# Altium schematic sheet 09_eMMC.SchDoc
size 420 x 297 mm; SheetNumber: 18; SheetTotal: 36
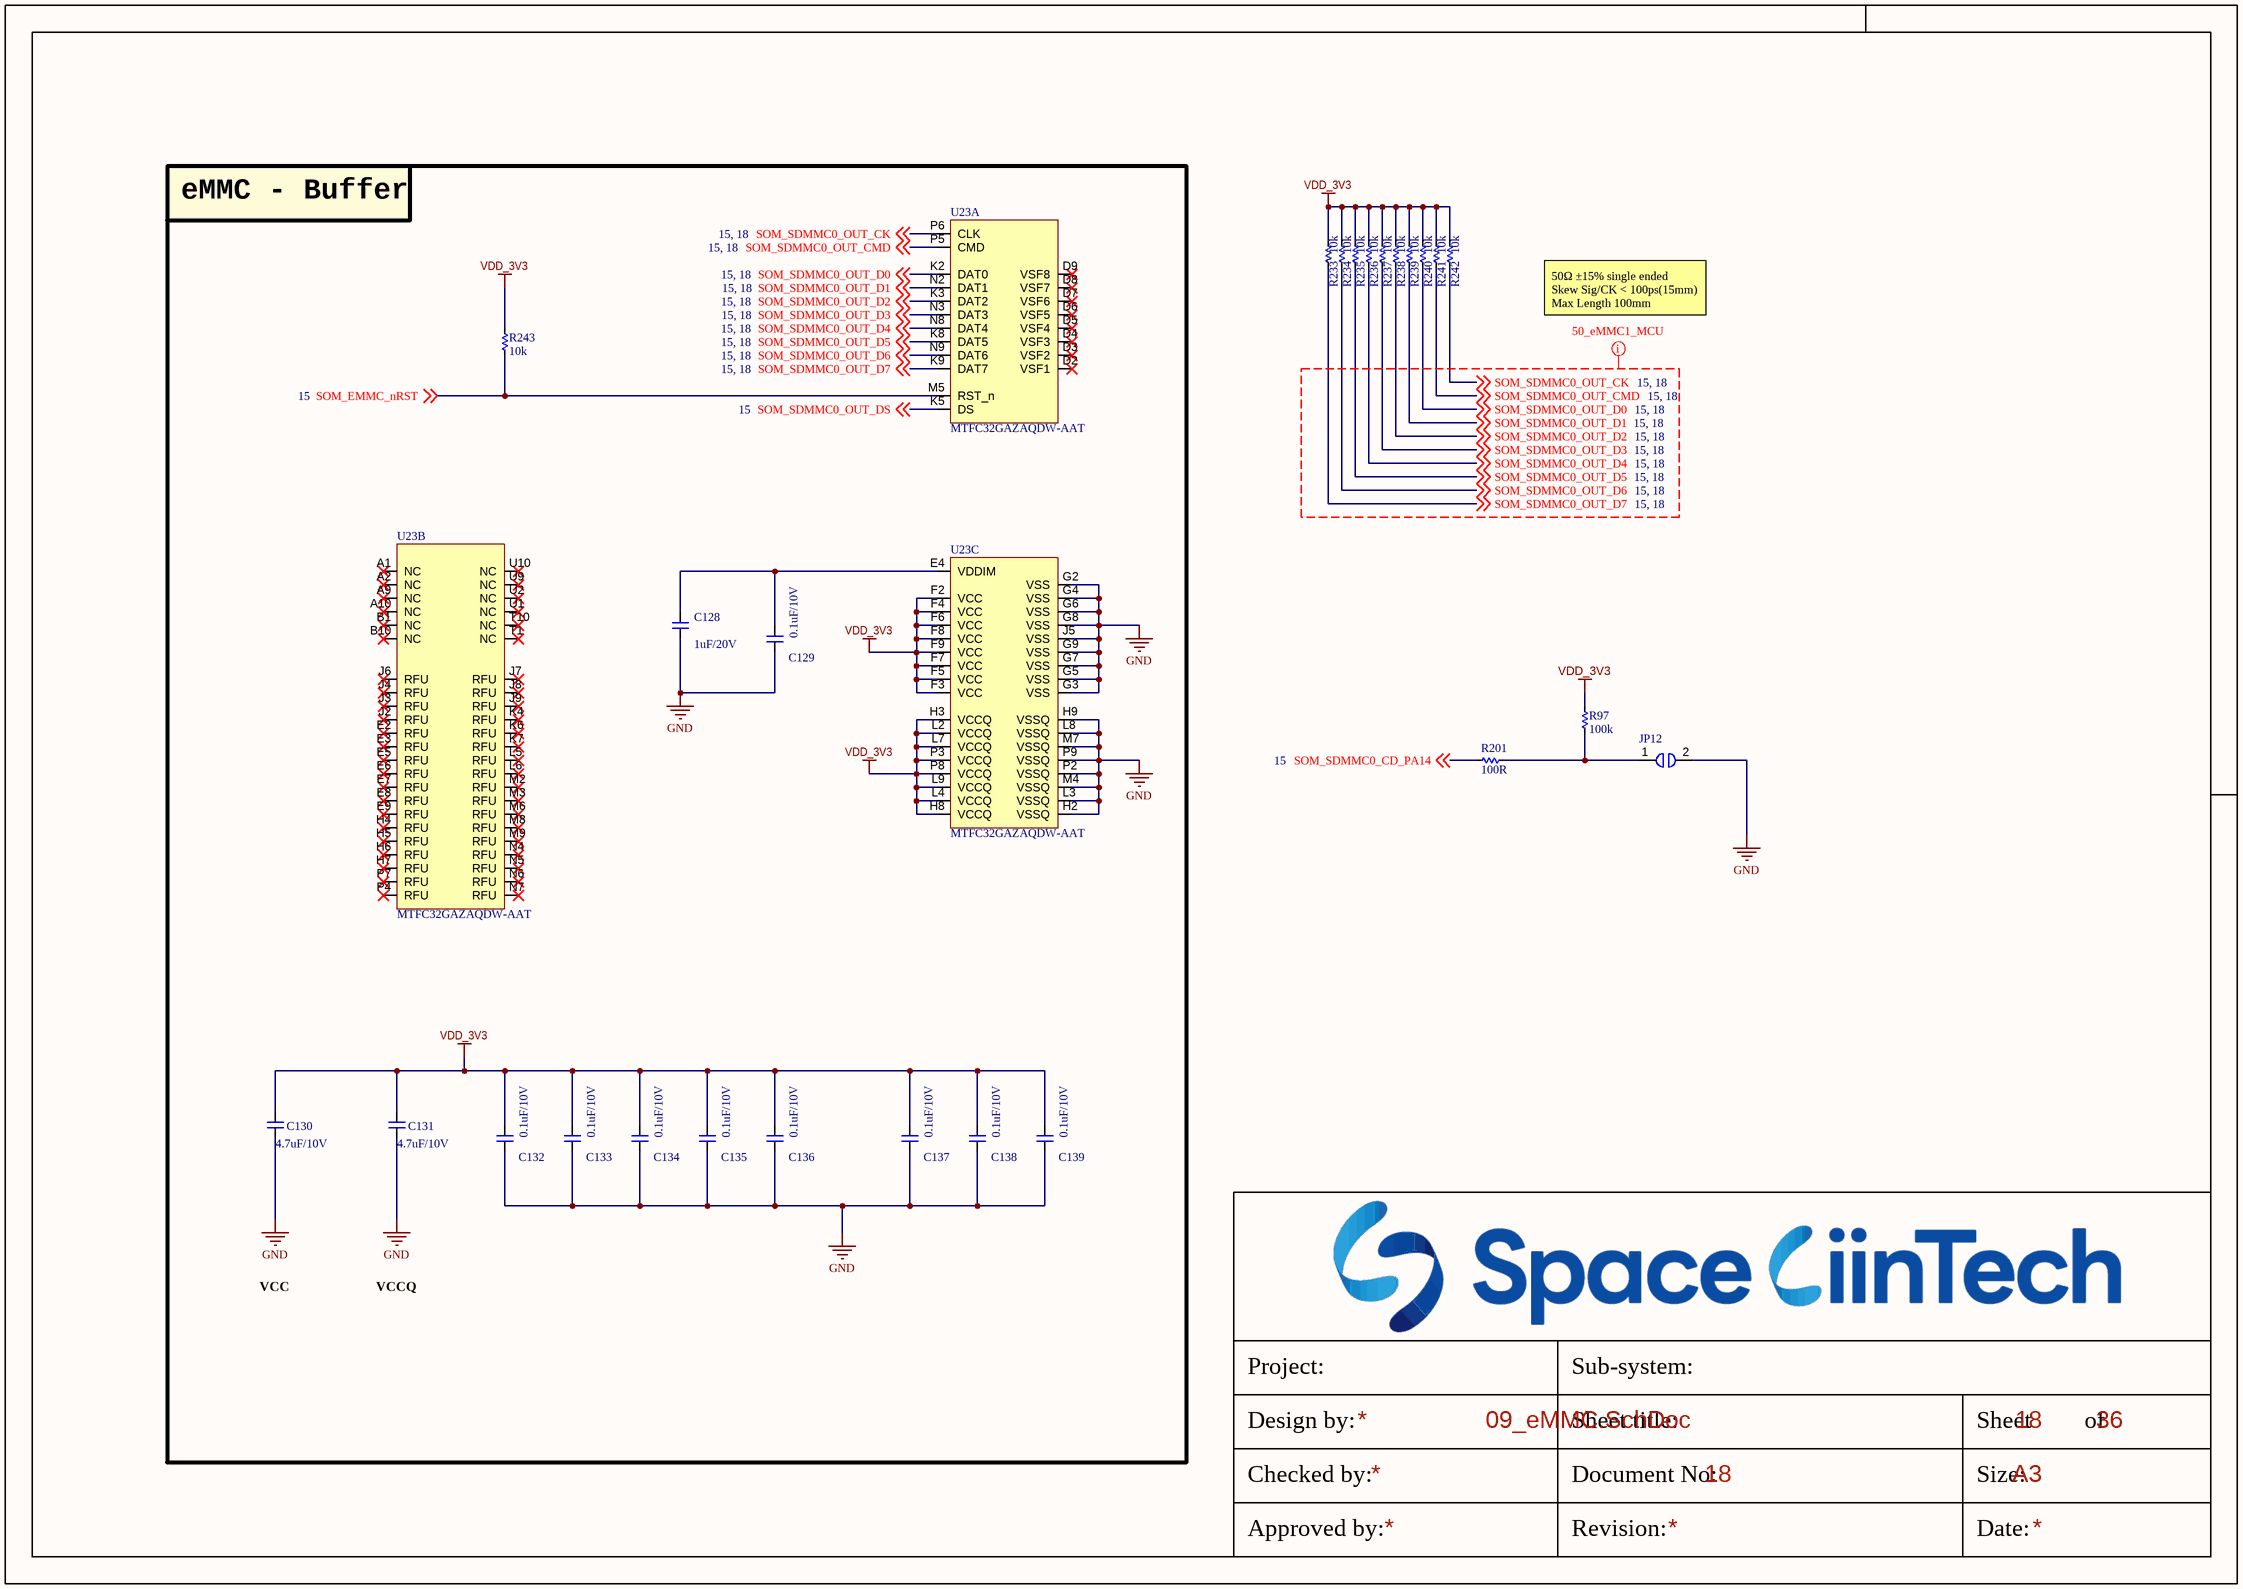
[diagram p0: 09_eMMC.SchDoc]

## Parts
C128  1uF/20V  [CAP_C_1005X60]
C129  0.1uF/10V  [CAP_C_1005X60]
C130  4.7uF/10V  [CAP_C_1005X60]
C131  4.7uF/10V  [CAP_C_1005X60]
C132  0.1uF/10V  [CAP_C_1005X60]
C133  0.1uF/10V  [CAP_C_1005X60]
C134  0.1uF/10V  [CAP_C_1005X60]
C135  0.1uF/10V  [CAP_C_1005X60]
C136  0.1uF/10V  [CAP_C_1005X60]
C137  0.1uF/10V  [CAP_C_1005X60]
C138  0.1uF/10V  [CAP_C_1005X60]
C139  0.1uF/10V  [CAP_C_1005X60]
JP12  (no value)  [TESTPOINT_SHORT_120X100_60]
R97  100k  [RES_C_1005X40]
R201  100R  [RES_C_1005X40]
R233  10k  [RES_C_1005X40]
R234  10k  [RES_C_1005X40]
R235  10k  [RES_C_1005X40]
R236  10k  [RES_C_1005X40]
R237  10k  [RES_C_1005X40]
R238  10k  [RES_C_1005X40]
R239  10k  [RES_C_1005X40]
R240  10k  [RES_C_1005X40]
R241  10k  [RES_C_1005X40]
R242  10k  [RES_C_1005X40]
R243  10k  [RES_C_1005X40]
U23  MTFC32GAZAQDW-AAT  [BGA_100_C_100P_10X17_1400X1800X150]  (parts A,B,C of 3)

## Blocks framed on the sheet
eMMC - Buffer: C128-C139 R243 U23

## Nets
GND: C128.1 C129.1 C130.1 C131.1 C132.1 C133.1 C134.1 C135.1 C136.1 C137.1 C138.1 C139.1 JP12.2 U23.G2(VSS) U23.G3(VSS) U23.G4(VSS) U23.G5(VSS) U23.G6(VSS) U23.G7(VSS) U23.G8(VSS) U23.G9(VSS) U23.H2(VSSQ) U23.H9(VSSQ) U23.J5(VSS) U23.L3(VSSQ) U23.L8(VSSQ) U23.M4(VSSQ) U23.M7(VSSQ) U23.P2(VSSQ) U23.P9(VSSQ)
VDD_3V3: C130.2 C131.2 C132.2 C133.2 C134.2 C135.2 C136.2 C137.2 C138.2 C139.2 R97.2 R233.2 R234.2 R235.2 R236.2 R237.2 R238.2 R239.2 R240.2 R241.2 R242.2 R243.2 U23.F2(VCC) U23.F3(VCC) U23.F4(VCC) U23.F5(VCC) U23.F6(VCC) U23.F7(VCC) U23.F8(VCC) U23.F9(VCC) U23.H3(VCCQ) U23.H8(VCCQ) U23.L2(VCCQ) U23.L4(VCCQ) U23.L7(VCCQ) U23.L9(VCCQ) U23.P3(VCCQ) U23.P8(VCCQ)
SOM_EMMC_nRST: R243.1 U23.M5(RST_n) ; off-sheet SOM_EMMC_nRST
SOM_SDMMC0_CD_PA14: R201.1 ; off-sheet SOM_SDMMC0_CD_PA14
SOM_SDMMC0_OUT_CK: R242.1 U23.P6(CLK) ; off-sheet SOM_SDMMC0_OUT_CK
SOM_SDMMC0_OUT_CMD: R241.1 U23.P5(CMD) ; off-sheet SOM_SDMMC0_OUT_CMD
SOM_SDMMC0_OUT_D0: R240.1 U23.K2(DAT0) ; off-sheet SOM_SDMMC0_OUT_D0
SOM_SDMMC0_OUT_D1: R239.1 U23.N2(DAT1) ; off-sheet SOM_SDMMC0_OUT_D1
SOM_SDMMC0_OUT_D2: R238.1 U23.K3(DAT2) ; off-sheet SOM_SDMMC0_OUT_D2
SOM_SDMMC0_OUT_D3: R237.1 U23.N3(DAT3) ; off-sheet SOM_SDMMC0_OUT_D3
SOM_SDMMC0_OUT_D4: R236.1 U23.N8(DAT4) ; off-sheet SOM_SDMMC0_OUT_D4
SOM_SDMMC0_OUT_D5: R235.1 U23.K8(DAT5) ; off-sheet SOM_SDMMC0_OUT_D5
SOM_SDMMC0_OUT_D6: R234.1 U23.N9(DAT6) ; off-sheet SOM_SDMMC0_OUT_D6
SOM_SDMMC0_OUT_D7: R233.1 U23.K9(DAT7) ; off-sheet SOM_SDMMC0_OUT_D7
SOM_SDMMC0_OUT_DS: U23.K5(DS) ; off-sheet SOM_SDMMC0_OUT_DS
NetC128_2: C128.2 C129.2 U23.E4(VDDIM)
NetJP12_1: JP12.1 R97.1 R201.2

Not connected (* = marked no-connect by the designer): U23 A1(NC)* A2(NC)* A9(NC)* A10(NC)* B1(NC)* B10(NC)* D2(VSF1)* D3(VSF2)* D4(VSF3)* D5(VSF4)* D6(VSF5)* D7(VSF6)* D8(VSF7)* D9(VSF8)* E2(RFU)* E3(RFU)* E5(RFU)* E6(RFU)* E7(RFU)* E8(RFU)* E9(RFU)* H4(RFU)* H5(RFU)* H6(RFU)* H7(RFU)* J2(RFU)* J3(RFU)* J4(RFU)* J6(RFU)* J7(RFU)* J8(RFU)* J9(RFU)* K4(RFU)* K6(RFU)* K7(RFU)* L5(RFU)* L6(RFU)* M2(RFU)* M3(RFU)* M6(RFU)* M8(RFU)* M9(RFU)* N4(RFU)* N5(RFU)* N6(RFU)* N7(RFU)* P4(RFU)* P7(RFU)* T1(NC)* T10(NC)* U1(NC)* U2(NC)* U9(NC)* U10(NC)*

## Layout directives
net class 50_eMMC1_MCU: SOM_SDMMC0_OUT_CK, SOM_SDMMC0_OUT_CMD, SOM_SDMMC0_OUT_D0, SOM_SDMMC0_OUT_D1, SOM_SDMMC0_OUT_D2, SOM_SDMMC0_OUT_D3, SOM_SDMMC0_OUT_D4, SOM_SDMMC0_OUT_D5, SOM_SDMMC0_OUT_D6, SOM_SDMMC0_OUT_D7

## Notes on the sheet
- 50Ω ±15% single ended
  Skew Sig/CK < 100ps(15mm)
  Max Length 100mm
- VCC
- VCCQ
- Project:
- Sub-system:
- Design by:
- Sheet title:
- Sheet
- of
- Checked by:
- Approved by:
- Revision:
- Document No:
- Size:
- Date:
- A3

## Library data of the parts
C128-C139 = _CAP_C_2: CAP
JP12 = JUMPER_1_1
R97 R201 R233-R243 = _RES_B_2: RES